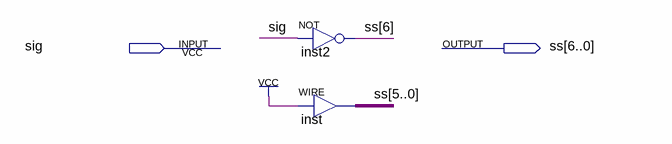
[diagram p0: schematic sheet]
// Quartus schematic CA2_SIG_SS.bdf as structural Verilog: 2 symbols, 2 pins
module CA2_SIG_SS (
  input  sig,
  output [6:0] ss
);

  not inst2 (ss[6], sig);
  assign ss[5:0] = {6{1'b1}};  // WIRE inst
endmodule
